# Altium schematic sheet STM32F103CBT6-sphbot.SchDoc
size A3; PageSetup: Record=PageOptions|CenterHorizontal=True|CenterVertical=True|PrintScale=0.73|XCorrection=1.00|YCorrection=1.00|PrintKind=1|BorderSize=5000000|LeftOffset=0|BottomOffset=0|Orientation=2|PaperLength=1000|PaperWidth=1000|Scale=100|PaperSource=7|PrintQuality=300|MediaType=1|DitherType=10|PaperKind=A4|PrintScaleMode=1
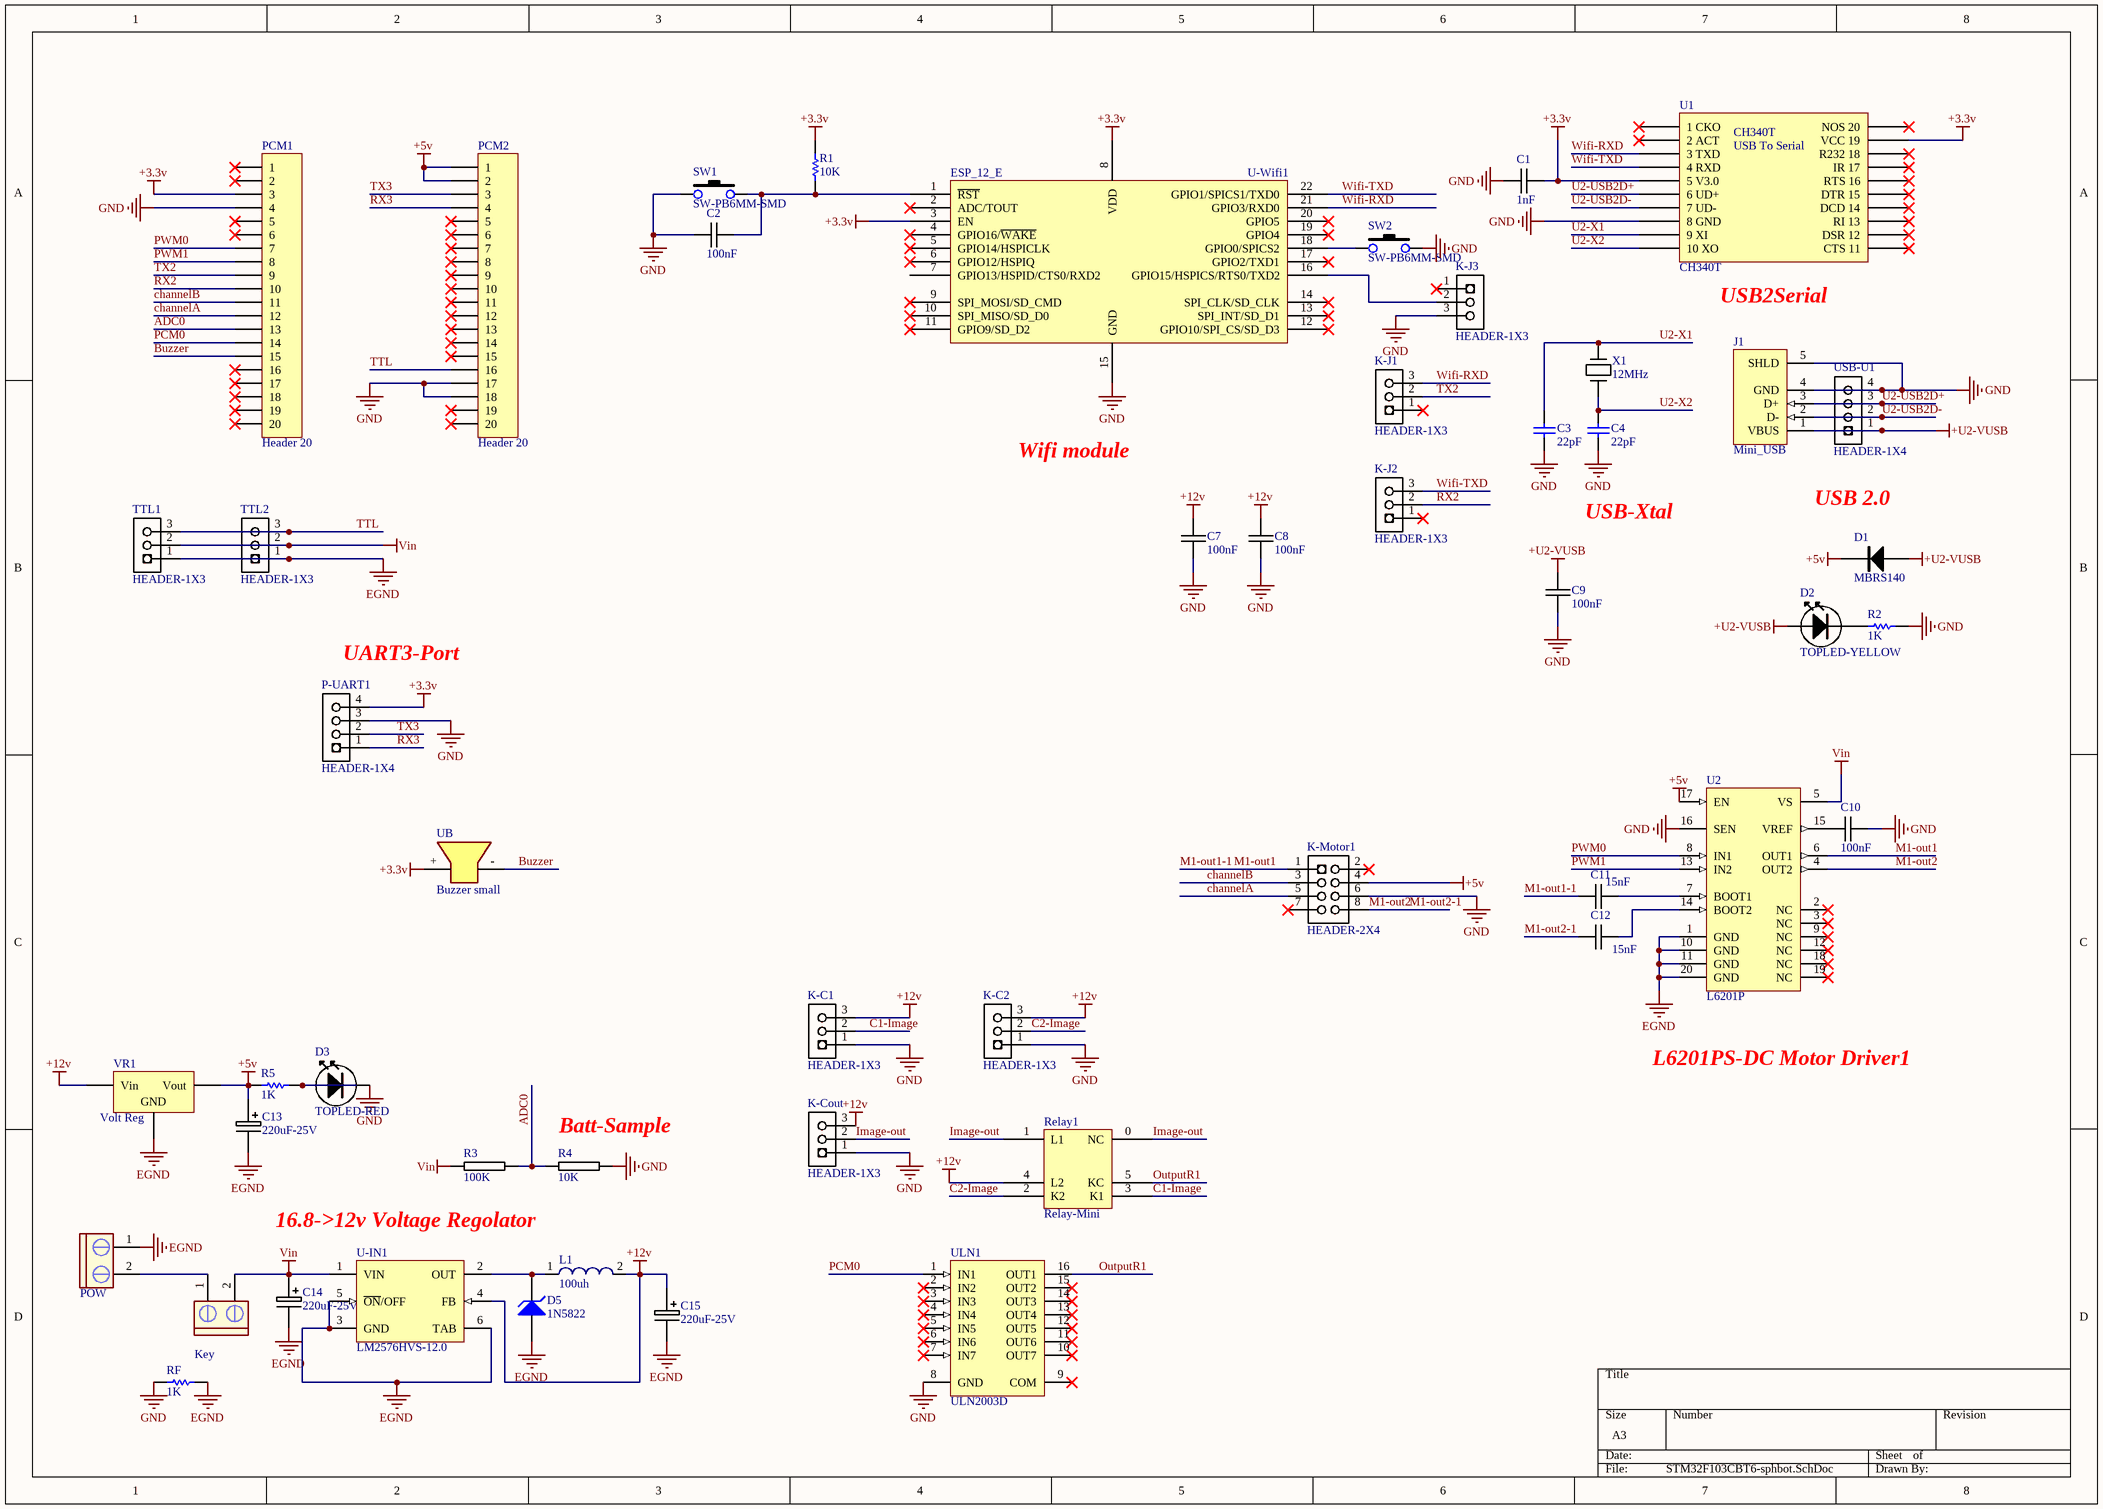
[diagram p0: STM32F103CBT6-sphbot.SchDoc]

## Parts
C1  1nF  [0805C-TBD]
C2  100nF  [0805C-TBD]
C3  22pF  [0805C-TBD]
C4  22pF  [0805C-TBD]
C7  100nF  [0805C-TBD]
C8  100nF  [0805C-TBD]
C9  100nF  [0805C-TBD]
C10  100nF  [0805C-TBD]
C11  15nF  [0805C-TBD]
C12  15nF  [0805C-TBD]
C13  220uF-25V  [PANACAP-F-GENERIC]
C14  220uF-25V  [PANACAP-F-GENERIC]
C15  220uF-25V  [PANACAP-F-GENERIC]
D1  MBRS140  [DIODE-SMA]
D2  TOPLED-YELLOW  [TOPLED-YELLOW]
D3  TOPLED-RED  [TOPLED-RED]
D5  1N5822  [MELF]
J1  Mini_USB  [My_USB]
K-C1  HEADER-1X3  [HEADER-1X3]
K-C2  HEADER-1X3  [HEADER-1X3]
K-Cout  HEADER-1X3  [HEADER-1X3]
K-J1  HEADER-1X3  [HEADER-1X3]
K-J2  HEADER-1X3  [HEADER-1X3]
K-J3  HEADER-1X3  [HEADER-1X3]
K-Motor1  HEADER-2X4  [HEADER-2X4]
Key  CON2 pin blue  [My_CN2]  (value not drawn)
L1  100uh  [WE-PD 1280]
P-UART1  HEADER-1X4  [HEADER-1X4]
PCM1  Header 20  [HDR1X20]
PCM2  Header 20  [HDR1X20]
POW  CON2 pin blue  [My_CN2]  (value not drawn)
R1  10K  [0805R-1K]
R2  1K  [0805R-1K]
R3  100K  [0805R-100K]
R4  10K  [0805R-10K]
R5  1K  [0805R-1K]
Relay1  Relay-Mini  [Relay_Mini]
RF  1K  [0805R-1K]
SW1  SW-PB6MM-SMD  [SW-PB-SMD]
SW2  SW-PB6MM-SMD  [SW-PB-SMD]
TTL1  HEADER-1X3  [HEADER-1X3]
TTL2  HEADER-1X3  [HEADER-1X3]
U1  CH340T  [TSSOP20]
U2  L6201P  [PowerSO20_N]
U-IN1  LM2576HVS-12.0  [TS5B_N]
U-Wifi1  ESP_12_E  [ESP_12_E]
UB  Buzzer small  [My_Buzzer]
ULN1  ULN2003D  [SO16_N]
USB-U1  HEADER-1X4  [HEADER-1X4]
VR1  Volt Reg  [D2PAK]
X1  12MHz  [XTAL-RU49/4]

## Nets
+3.3v: C1.1 P-UART1.4 PCM1.3 R1.2 U1.5(5_V3.0) U1.19(VCC_19) U-Wifi1.3(EN) U-Wifi1.8(VDD) UB.+
+5v: C13.+ D1.K K-Motor1.4 PCM2.1 PCM2.2 R5.2 U2.17(EN) VR1.3(Vout)
+12v: C7.1 C8.1 C15.+ K-C1.3 K-C2.3 K-Cout.3 L1.2 Relay1.4(L2) U-IN1.4(FB) VR1.1(Vin)
+U2-VUSB: C9.1 D1.A D2.A J1.1(VBUS) USB-U1.1
EGND: C13.- C14.- C15.- D5.1(A) POW.1 RF.1 TTL1.1 TTL2.1 U2.1(GND) U2.10(GND) U2.11(GND) U2.20(GND) U-IN1.3(GND) U-IN1.5(~{ON}/OFF) U-IN1.6(TAB) VR1.2(GND)
GND: C1.2 C2.2 C3.1 C4.1 C7.2 C8.2 C9.2 C10.2 D3.K J1.4(GND) J1.5(SHLD) K-C1.1 K-C2.1 K-Cout.1 K-J3.3 K-Motor1.6 P-UART1.3 PCM1.4 PCM2.17 PCM2.18 R2.1 R4.2 RF.2 SW1.1 SW2.2 U1.8(8_GND) U2.16(SEN) U-Wifi1.15(GND) ULN1.8(GND) USB-U1.4
Vin: C14.+ Key.2 R3.1 TTL1.2 TTL2.2 U2.5(VS) U-IN1.1(VIN)
ADC0: PCM1.13 R3.2 R4.1
Buzzer: PCM1.15 UB.-
C1-Image: K-C1.2 Relay1.3(K1)
C2-Image: K-C2.2 Relay1.2(K2)
channelA: K-Motor1.5 PCM1.12
channelB: K-Motor1.3 PCM1.11
Image-out: K-Cout.2 Relay1.0(NC) Relay1.1(L1)
M1-out1: C11.1 K-Motor1.1 U2.6(OUT1)  [also labelled M1-out1-1]
M1-out2: C12.1 K-Motor1.8 U2.4(OUT2)  [also labelled M1-out2-1]
OutputR1: Relay1.5(KC) ULN1.16(OUT1)
PCM0: PCM1.14 ULN1.1(IN1)
PWM0: PCM1.7 U2.8(IN1)
PWM1: PCM1.8 U2.13(IN2)
RX2: K-J2.2 PCM1.10
RX3: P-UART1.1 PCM2.4
TTL: PCM2.16 TTL1.3 TTL2.3
TX2: K-J1.2 PCM1.9
TX3: P-UART1.2 PCM2.3
U2-USB2D+: J1.3(D+) U1.6(6_UD+) USB-U1.3
U2-USB2D-: J1.2(D-) U1.7(7_UD-) USB-U1.2
U2-X1: C3.2 U1.9(9_XI) X1.1
U2-X2: C4.2 U1.10(10_XO) X1.2
Wifi-RXD: K-J1.3 U1.3(3_TXD) U-Wifi1.21(GPIO3/RXD0)
Wifi-TXD: K-J2.3 U1.4(4_RXD) U-Wifi1.22(GPIO1/SPICS1/TXD0)
NetC2_1: C2.1 R1.1 SW1.2 U-Wifi1.1(~{RST})
NetC10_1: C10.1 U2.15(VREF)
NetC11_2: C11.2 U2.7(BOOT1)
NetC12_2: C12.2 U2.14(BOOT2)
NetD2_K: D2.K R2.2
NetD3_A: D3.A R5.1
NetD5_2: D5.2(K) L1.1 U-IN1.2(OUT)
NetK-J3_2: K-J3.2 U-Wifi1.16(GPIO15/HSPICS/RTS0/TXD2)
NetKey_1: Key.1 POW.2
NetSW2_1: SW2.1 U-Wifi1.18(GPIO0/SPICS2)

Not connected (* = marked no-connect by the designer): K-J1 1*; K-J2 1*; K-J3 1*; K-Motor1 2* 7*; PCM1 1* 2* 5* 6* 16* 17* 18* 19* 20*; PCM2 5* 6* 7* 8* 9* 10* 11* 12* 13* 14* 15* 19* 20*; U1 1(1_CKO)* 2(2_ACT)* 11(CTS_11)* 12(DSR_12)* 13(RI_13)* 14(DCD_14)* 15(DTR_15)* 16(RTS_16)* 17(IR_17)* 18(R232_18)* 20(NOS_20)*; U2 2(NC)* 3(NC)* 9(NC)* 12(NC)* 18(NC)* 19(NC)*; U-Wifi1 2(ADC/TOUT)* 4(GPIO16/~{WAKE})* 5(GPIO14/HSPICLK)* 6(GPIO12/HSPIQ)* 7(GPIO13/HSPID/CTS0/RXD2) 9(SPI_MOSI/SD_CMD)* 10(SPI_MISO/SD_D0)* 11(GPIO9/SD_D2)* 12(GPIO10/SPI_CS/SD_D3)* 13(SPI_INT/SD_D1)* 14(SPI_CLK/SD_CLK)* 17(GPIO2/TXD1)* 19(GPIO4)* 20(GPIO5)*; ULN1 2(IN2)* 3(IN3)* 4(IN4)* 5(IN5)* 6(IN6)* 7(IN7)* 9(COM)* 10(OUT7)* 11(OUT6)* 12(OUT5)* 13(OUT4)* 14(OUT3)* 15(OUT2)*

## Notes on the sheet
- USB2Serial
- Wifi module
- USB 2.0
- USB-Xtal
- (near P-UART1) UART3-Port
- L6201PS-DC Motor Driver1
- (near R4) Batt-Sample
- 16.8->12v Voltage Regolator
- (in symbol CH340T) USB To Serial

## Library data of the parts
C1 = 0805C-18PF-50V-C0G-JOH: CAPACITOR 0805 CERAMIC; Supplier 1: Digi-Key; Supplier Part Number 1: 709-1171-2-ND
C2 C7-C12 = 0805C-100nF-25V-X7R-MUR: CAPACITOR 0805 CERAMIC; Supplier 1: Digi-Key; Supplier Part Number 1: 490-1673-1-ND
C3 C4 = Cap Semi: Capacitor (Semiconductor SIM Model); Published: 8-Jun-2000; LatestRevisionDate: 29-May-2009; LatestRevisionNote: IPC-7351 Footprint Added.; PackageReference: C1206; Publisher: Altium Limited; PackageDescription: Chip Capacitor; Value: 22pF
C13-C15 = PANACAP-220UF-25V-FK: GENERIC CAPACITOR POLARISED; Supplier 1: Digi-Key; Supplier Part Number 1: PCE3400TR-ND
D1 = MBRS140: DIODE; Supplier 1: Digi-Key; Supplier Part Number 1: MBRS140FSTR-ND
D2 = TOPLED-YELLOW: Manufacturer Part Number: LY T676-S1T1-26-Z; Manufacturer: OSRAM Opto Semiconductors Inc; Supplier 1: Digi-Key; Supplier Part Number 1: 475-2665-2-ND
D3 = TOPLED-BLUE: Manufacturer: Kingbright Corp; Manufacturer Part Number: AA3528APBC/A; Supplier 1: Digi-Key; Supplier Part Number 1: 754-1011-2-ND
D5 = ZMU100: High-Voltage Power Zener Diode; Published: 8-Jun-2000; LatestRevisionDate: 19-Mar-2004; LatestRevisionNote: Silkscreen size reduced.; DatasheetDocument: 16-May-1997; PackageDocument: May-1997; PackageReference: MELF; Publisher: Altium Limited; ComponentLink1Description: Manufacturer Link; ComponentLink1URL: http://www.vishay.com/
J1 = Mini_USB: USB 2.0, Right Angle, SMT, B Type, Receptacle, 5 Position, Black; ContactMaterial: Copper Alloy; ContactPlating: Gold (30); PCB_Layout: Complies with manufacturer's recommendation.; DrillSize: Corresponds to nominal value.; PanelGround: Without; Published: 15-Jul-2004; DatasheetDocument: 27-Jun-2003; PackageDocument: 27-Jun-2003; PackageReference: 440247; Publisher: Altium Limited; HousingMaterial: Thermoplastic; ComponentLink1Description: Manufacturer Link; ComponentLink1URL: http://www.tycoelectronics.com/; ComponentLink2Description: Packaging Specification; ComponentLink2URL: http://ecommas.tycoelectronics.com/commerce/DocumentDelivery/DDEController?Action=showdoc&DocId=Customer+Drawing%7F440247%7FD%7Fpdf%7FEnglish%7FC_440247_D.pdf
Key POW = CON2 pin blue: Connector blue screw
L1 = WE-PD 1280, XL, 744770122: SMD-Shielded Power Inductor WE-PD, L=22.0 µH; Manufacturer: Würth Elektronik eiSos GmbH; Inductance: 22.0 µH; partNo: 744770122; ComponentLink1Description: Manufacturer; ComponentLink1URL: http://www.we-online.de; Created by: Christin Zierenner; Created Date: August 2009; ComponentLink2Description: Datasheet; ComponentLink2URL: http://www.we-online.de/katalog/media/pdf/744770122.pdf
PCM1 PCM2 = Header 20: Header, 20-Pin; LatestRevisionDate: 17-Jul-2002; LatestRevisionNote: Re-released for DXP Platform.; Publisher: Altium Limited
R1 R5 RF = ERJ6RS: Low Ohmic Value Thick Film Chip Resistor, 0.1 Ohm to 0.2 Ohm Range, 1%, 2% and 5% Tolerance, 0805 Size, 0.125 W; Published: 17-Dec-2003; LatestRevisionDate: 19-Mar-2004; LatestRevisionNote: Silkscreen size reduced.; PackageDocument: Mar-2003; PackageReference: 6-0805; Publisher: Altium Limited; Code_IPC: 2012 [0805]; ComponentLink1Description: Manufacturer Link; ComponentLink1URL: http://www.panasonic.com/industrial/components/resistive_products.htm; ComponentLink2Description: Datasheet; ComponentLink2URL: http://www.panasonic.com/industrial/components/pdf/AOA0000CE3.pdf
R2 = Res Semi: Semiconductor Resistor; Published: 8-Jun-2000; LatestRevisionDate: 17-Jul-2002; LatestRevisionNote: Re-released for DXP Platform.; PackageReference: AXIAL-0.5; Publisher: Altium Limited; Value: 1K
R3 = 0805R-100K: RESISTOR 0805 1/4 WATT THIN FILM; Reel: *; Supplier 1: Digi-Key; Supplier Part Number 1: RMCF0805FT100KTR-ND
R4 = 0805R-10K: RESISTOR 0805 1/4 WATT THIN FILM; Reel: *
SW1 SW2 = SW-PB6MM-SMD: PUSHBUTTON SWITCH 6MM SMD
U2 = L6201P: DMOS Full Bridge Driver; Published: 8-Jun-2000; LatestRevisionDate: 13-Apr-2006; LatestRevisionNote: IPC-7351 Footprint Added.; DatasheetVersion: Sep-1996; PackageVersion: May-1998; PackageReference: PowerSO20; Publisher: Altium Limited; PackageDescription: 20-Pin Small Outline Package 1.27 mm Pitch; Code_JEDEC: MO-166; ComponentLink1Description: Manufacturer Link; ComponentLink1URL: http://www.st.com/
U-IN1 = LM2576HVS-5.0: SIMPLE SWITCHER; 3A Step-Down Voltage Regulator; Manufacturer: National Semiconductor; PackageTopMarking: NSUZXYTT*LM2576*HVS-5.0 P+; PowerWise: N; Published: 4-Dec-2008; DatasheetVersion: Aug-2004; PackageVersion: revD, Apr-2005; PackageReference: TS5B; Publisher: Altium Limited; PackageDescription: TO-263, Molded, .400 x .390 x .180in, 5 Lead, .067in Pitch, Surface Mount; CompType: Switcher; PartNumber: LM2576HVS-5.0; RoHS: O; PinCount: 5; DigiKeyPartNumber: LM2576HVS-5.0-ND; Code_JEDEC: MO-169-AB; ComponentLink1Description: LM2576HV Datasheet; ComponentLink1URL: http://www.national.com/ds/LM/LM2576HV.pdf; ComponentLink2Description: LM2576HV Web Page; ComponentLink2URL: http://www.national.com/pf/LM/LM2576HV.html; ComponentLink3Description: TS5B Package Page; ComponentLink3URL: http://www.national.com/packaging/folders/ts5b.html
U-Wifi1 = ESP_12_E: ESP-12 Wi-Fi Module by AI-Thinker; IC: ESP8266-EX; Vendor: Ai-thinker
UB = Buzzer: 5-12v small buzzer (12mm)
ULN1 = ULN2002D: Seven Darlington Array; Published: 8-Jun-2000; LatestRevisionDate: 13-Apr-2006; LatestRevisionNote: IPC-7351 Footprint Added.; DatasheetVersion: Sep-1998; PackageVersion: May-1998; PackageReference: SO16; Publisher: Altium Limited; PackageDescription: 16-Pin Small Outline Integrated Circuit 1.27 mm Pitch; Code_IPC: SOIC127P600-16; ComponentLink1Description: Manufacturer Link; ComponentLink1URL: http://www.st.com/; ComponentLink2Description: Datasheet; ComponentLink2URL: http://www.st.com/stonline/products/literature/ds/5279/uln2001.pdf
VR1 = Volt Reg: Voltage Regulator; Published: 24-Mar-1999; LatestRevisionDate: 17-Jul-2002; LatestRevisionNote: Re-released for DXP Platform.; PackageReference: D2PAK; Publisher: Altium Limited; Code_JEDEC: SMD-220
X1 = CRYSTAL-GENERIC: GENERIC CRYSTAL
K-C1 K-C2 K-Cout K-J1-K-J3 TTL1 TTL2 = HEADER-1X3: Supplier 1: Digi-Key; Supplier Part Number 1: S1011E-36-ND
P-UART1 USB-U1 = HEADER-1X4: Supplier 1: Digi-Key; Supplier Part Number 1: S1011E-36-ND